# Altium project PolarGraph.PrjPcb
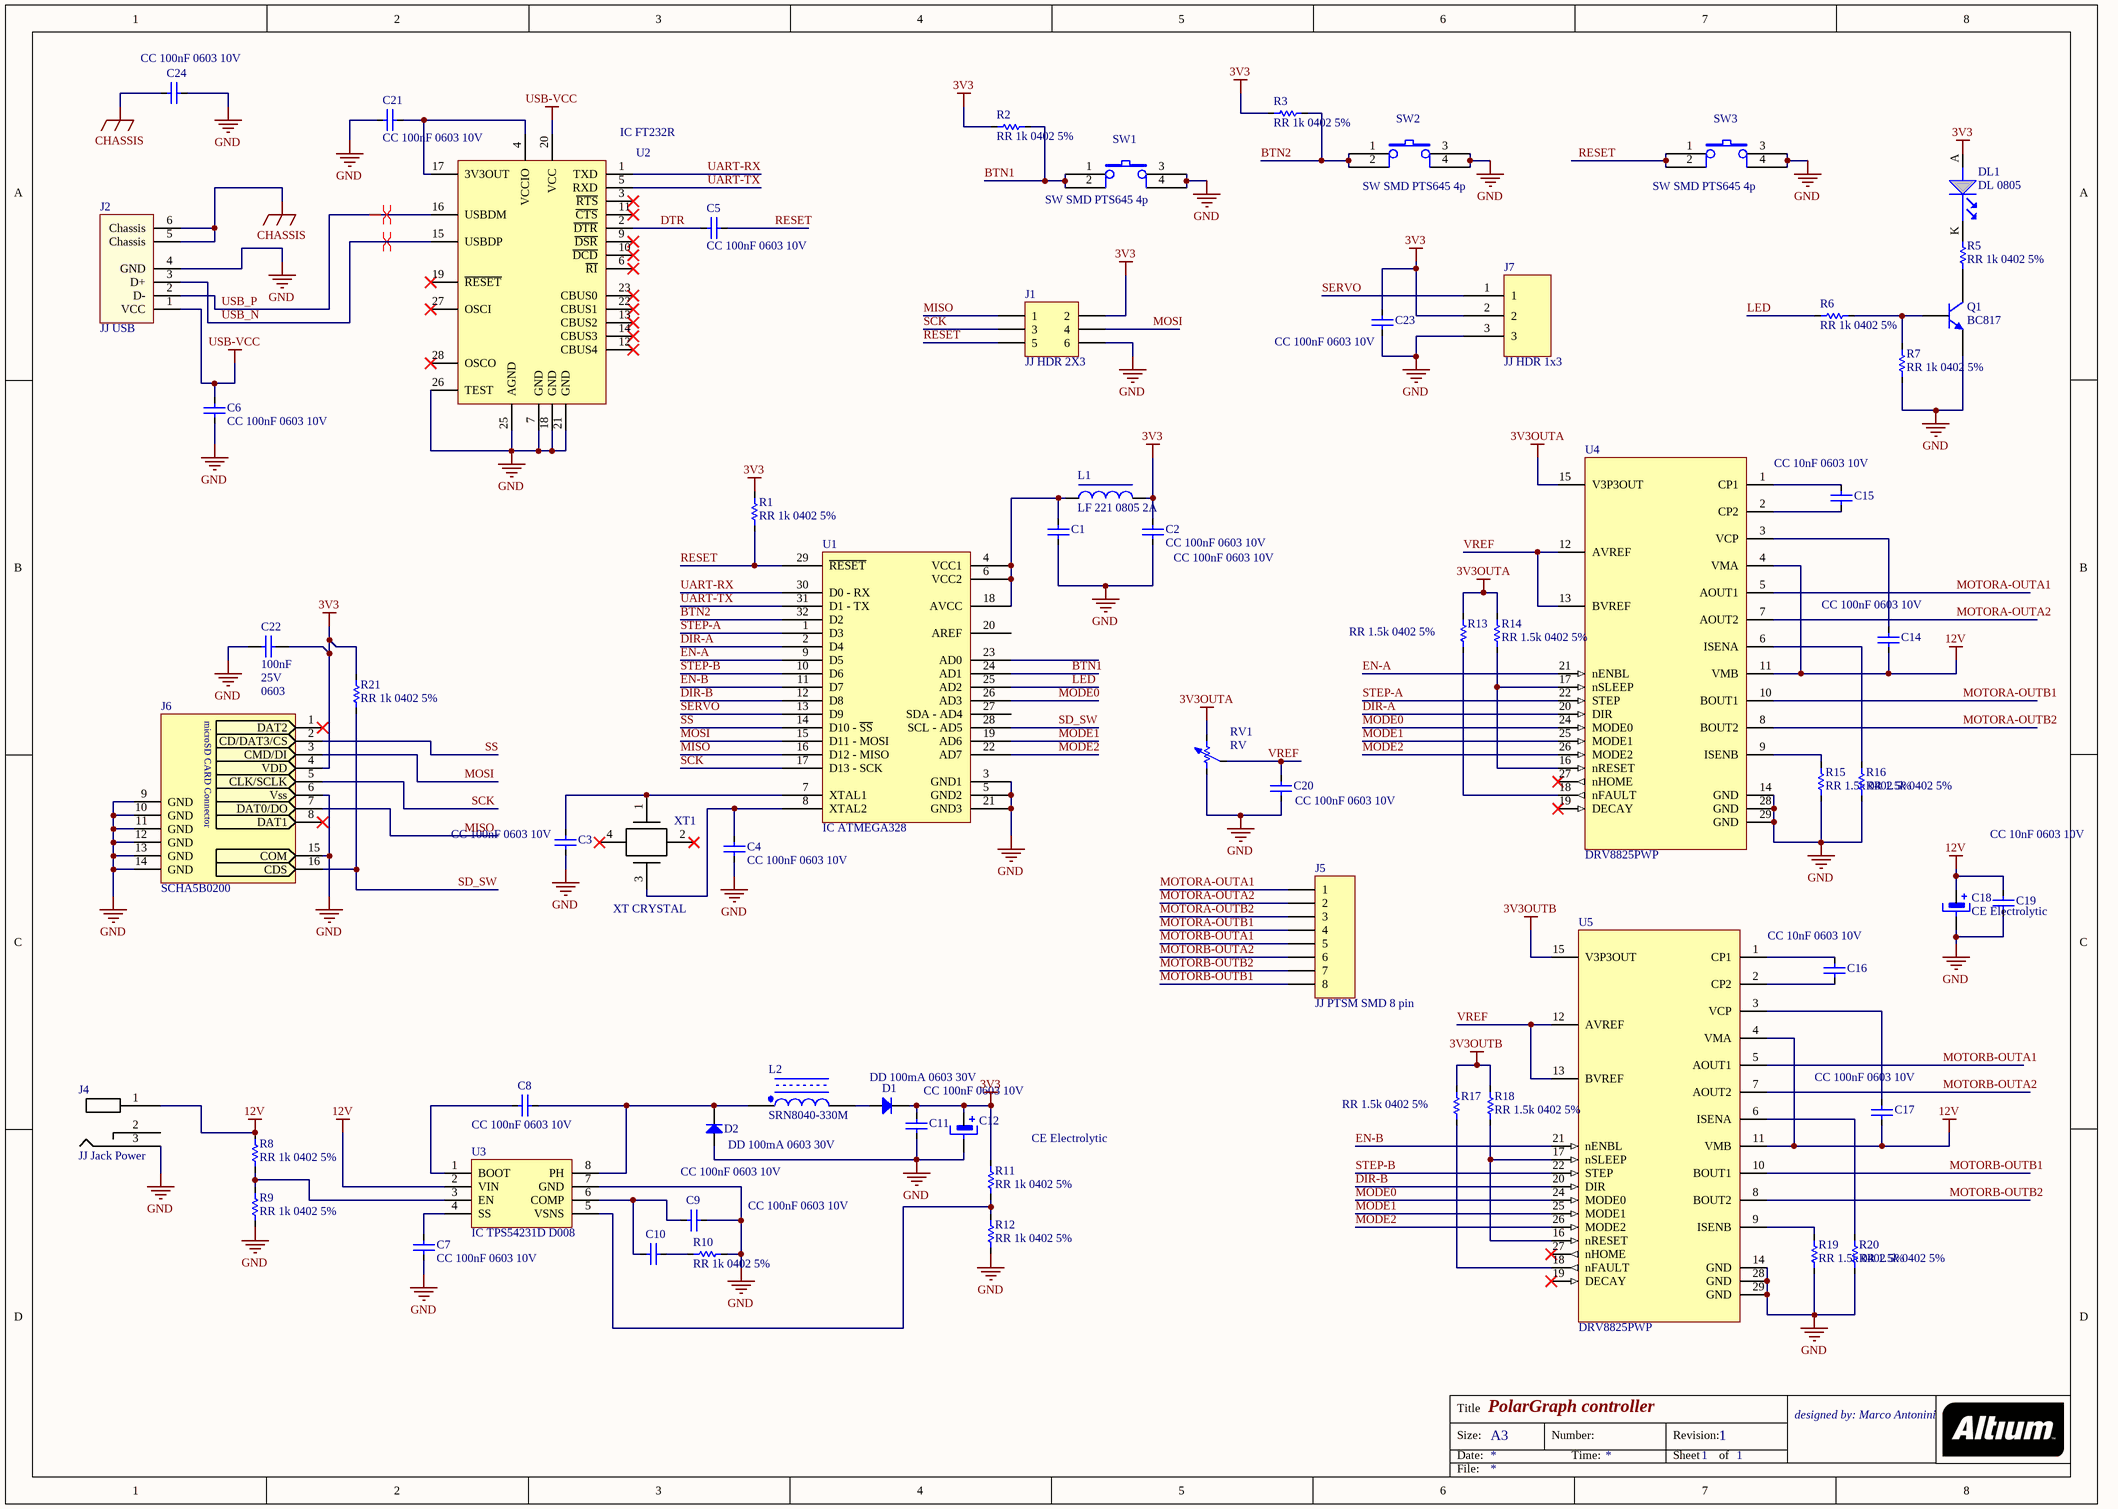
[diagram p0: PolarGraph.SchDoc]
2 sheets, 65 parts. Net scope: global (net labels, ports and power ports of the same name join across sheets).
Board file: PolarGraph.PcbDoc
Sheets:
  PolarGraph.SchDoc
  motorDriver.SchDoc

## Sheet PolarGraph.SchDoc: PolarGraph controller
size A3; ApprovedBy: I.C.T valle Umbra; DrawnBy: Marco Antonini; Address1: designed by: Marco Antonini; Revision: 1; SheetNumber: 1; SheetTotal: 1

### Parts
C1  CC 100nF 0603 10V  [CC 0603 (1608 metric)]
C2  CC 100nF 0603 10V  [CC 0603 (1608 metric)]
C3  CC 100nF 0603 10V  [CC 0603 (1608 metric)]
C4  CC 100nF 0603 10V  [CC 0603 (1608 metric)]
C5  CC 100nF 0603 10V  [CC 0603 (1608 metric)]
C6  CC 100nF 0603 10V  [CC 0603 (1608 metric)]
C7  CC 100nF 0603 10V  [CC 0603 (1608 metric)]
C8  CC 100nF 0603 10V  [CC 0603 (1608 metric)]
C9  CC 100nF 0603 10V  [CC 0603 (1608 metric)]
C10  CC 100nF 0603 10V  [CC 0603 (1608 metric)]
C11  CC 100nF 0603 10V  [CC 0805 (2012 metric)]
C12  CE Electrolytic  [CE 5.3x5.3x5.4]
C14  CC 100nF 0603 10V  [CC 0603 (1608 metric)]
C15  CC 10nF 0603 10V  [CC 0603 (1608 metric)]
C16  CC 10nF 0603 10V  [CC 0603 (1608 metric)]
C17  CC 100nF 0603 10V  [CC 0603 (1608 metric)]
C18  CE Electrolytic  [CE 6.6x6.6x5.4]
C19  CC 10nF 0603 10V  [CC 0805 (2012 metric)]
C20  CC 100nF 0603 10V  [CC 0603 (1608 metric)]
C21  CC 100nF 0603 10V  [CC 0603 (1608 metric)]
C22  value 100nF  Voltage: 25V  Package: 0603  [0603_C]  (hidden comment: Cap)
C23  CC 100nF 0603 10V  [CC 0805 (2012 metric)]
C24  CC 100nF 0603 10V  [CC 1808 (4520 metric)]
D1  DD 100mA 0603 30V  [DD SMA + SMB]
D2  DD 100mA 0603 30V  [DD SMA + SMB]
DL1  DL 0805  [LED 0805 - RED]
J1  JJ HDR 2X3  [HDR 2X3]
J2  JJ USB  [USB Type B]
J4  JJ Jack Power  [JACK POWER]
J5  JJ PTSM SMD 8 pin  [PTSM 0,5/ 8-2,5-H SMD]
J6  SCHA5B0200  [ALPS_SCHA5B0200]
J7  JJ HDR 1x3  [HDR 1x3]
L1  LF 221 0805 2A  [LL 0603 (1608 metric)]
L2  SRN8040-330M  [INDC8080X400N]
Q1  BC817  [SOT23_3]
R1  RR 1k 0402 5%  [RR 0603 (1608 metric)]
R2  RR 1k 0402 5%  [RR 0603 (1608 metric)]
R3  RR 1k 0402 5%  [RR 0603 (1608 metric)]
R5  RR 1k 0402 5%  [RR 0603 (1608 metric)]
R6  RR 1k 0402 5%  [RR 0603 (1608 metric)]
R7  RR 1k 0402 5%  [RR 0603 (1608 metric)]
R8  RR 1k 0402 5%  [RR 0603 (1608 metric)]
R9  RR 1k 0402 5%  [RR 0603 (1608 metric)]
R10  RR 1k 0402 5%  [RR 0603 (1608 metric)]
R11  RR 1k 0402 5%  [RR 0603 (1608 metric)]
R12  RR 1k 0402 5%  [RR 0603 (1608 metric)]
R13  RR 1.5k 0402 5%  [RR 0603 (1608 metric)]
R14  RR 1.5k 0402 5%  [RR 0603 (1608 metric)]
R15  RR 1.5k 0402 5%  [RR 0603 (1608 metric)]
R16  RR 1.5k 0402 5%  [RR 0603 (1608 metric)]
R17  RR 1.5k 0402 5%  [RR 0603 (1608 metric)]
R18  RR 1.5k 0402 5%  [RR 0603 (1608 metric)]
R19  RR 1.5k 0402 5%  [RR 0603 (1608 metric)]
R20  RR 1.5k 0402 5%  [RR 0603 (1608 metric)]
R21  RR 1k 0402 5%  [RR 0603 (1608 metric)]
RV1  RV  [RV ST-4EB]
SW1  SW SMD PTS645 4p  [Switch-4p PTS645]
SW2  SW SMD PTS645 4p  [Switch-4p PTS645]
SW3  SW SMD PTS645 4p  [Switch-4p PTS645]
U1  IC ATMEGA328  [TQFP32]
U2  IC FT232R  [SSOP28-FTDI]
U3  IC TPS54231D D008  [D008_M]
U4  DRV8825PWP  [SOP65P640X120_HS-28N]
U5  DRV8825PWP  [SOP65P640X120_HS-28N]
XT1  XT CRYSTAL  [CRYSTAL 3.8x10.3]

### Nets
3V3: C2.1 C11.1 C12.1 C22.2 C23.1 D1.K DL1.A J1.2 J6.4(VDD) J7.2 L1.2 R1.1 R2.2 R3.2 R11.2 R21.1
3V3OUTA: R13.2 R14.2 RV1.3 U4.15(V3P3OUT)
3V3OUTB: R17.2 R18.2 U5.15(V3P3OUT)
12V: C14.1 C17.1 C18.1 C19.2 J4.1 R8.2 U3.2(VIN) U4.4(VMA) U4.11(VMB) U5.4(VMA) U5.11(VMB)
CHASSIS: C24.1 J2.5(Chassis) J2.6(Chassis)
GND: C1.2 C2.2 C3.1 C4.1 C6.1 C7.2 C9.1 C11.2 C12.2 C18.2 C19.1 C20.2 C21.2 C22.1 C23.2 C24.2 D2.A J1.6 J2.4(GND) J4.3 J6.6(Vss) J6.9(GND) J6.10(GND) J6.11(GND) J6.12(GND) J6.13(GND) J6.14(GND) J6.15(COM) J7.3 Q1.2(E) R7.1 R9.1 R10.1 R12.1 R15.2 R16.2 R19.2 R20.2 RV1.1 SW1.3 SW1.4 SW2.3 SW2.4 SW3.3 SW3.4 U1.3(GND1) U1.5(GND2) U1.21(GND3) U2.7(GND) U2.18(GND) U2.21(GND) U2.25(AGND) U2.26(TEST) U3.7(GND) U4.14(GND) U4.28(GND) U4.29(GND) U5.14(GND) U5.28(GND) U5.29(GND)
USB-VCC: C6.2 J2.1(VCC) U2.20(VCC)
BTN1: R2.1 SW1.1 SW1.2 U1.24(AD1)
BTN2: R3.1 SW2.1 SW2.2 U1.32(D2)
DIR-A: U1.2(D4) U4.20(DIR)
DIR-B: U1.12(D8) U5.20(DIR)
DTR: C5.1 U2.2(~{DTR})
EN-A: U1.9(D5) U4.21(nENBL)
EN-B: U1.11(D7) U5.21(nENBL)
LED: R6.1 U1.25(AD2)
MISO: J1.1 J6.7(DAT0/DO) U1.16(D12_-_MISO)
MODE0: U1.26(AD3) U4.24(MODE0) U5.24(MODE0)
MODE1: U1.19(AD6) U4.25(MODE1) U5.25(MODE1)
MODE2: U1.22(AD7) U4.26(MODE2) U5.26(MODE2)
MOSI: J1.4 J6.3(CMD/DI) U1.15(D11_-_MOSI)
MOTORA-OUTA1: J5.1 U4.5(AOUT1)
MOTORA-OUTA2: J5.2 U4.7(AOUT2)
MOTORA-OUTB1: J5.4 U4.10(BOUT1)
MOTORA-OUTB2: J5.3 U4.8(BOUT2)
MOTORB-OUTA1: J5.5 U5.5(AOUT1)
MOTORB-OUTA2: J5.6 U5.7(AOUT2)
MOTORB-OUTB1: J5.8 U5.10(BOUT1)
MOTORB-OUTB2: J5.7 U5.8(BOUT2)
RESET: C5.2 J1.5 R1.2 SW3.1 SW3.2 U1.29(~{RESET})
SCK: J1.3 J6.5(CLK/SCLK) U1.17(D13_-_SCK)
SD_SW: J6.16(CDS) R21.2 U1.28(SCL_-_AD5)
SERVO: J7.1 U1.13(D9)
SS: J6.2(CD/DAT3/CS) U1.14(D10_-_~{SS})
STEP-A: U1.1(D3) U4.22(STEP)
STEP-B: U1.10(D6) U5.22(STEP)
UART-RX: U1.30(D0_-_RX) U2.1(TXD)
UART-TX: U1.31(D1_-_TX) U2.5(RXD)
USB_N: J2.3(D+) U2.15(USBDP)
USB_P: J2.2(D-) U2.16(USBDM)
VREF: C20.1 RV1.2 U4.12(AVREF) U4.13(BVREF) U5.12(AVREF) U5.13(BVREF)
NetC1_1: C1.1 L1.1 U1.4(VCC1) U1.6(VCC2) U1.18(AVCC)
NetC3_2: C3.2 U1.7(XTAL1) XT1.1(X1)
NetC4_2: C4.2 U1.8(XTAL2) XT1.3(X2)
NetC7_1: C7.1 U3.4(SS)
NetC8_1: C8.1 D2.K L2.1 U3.8(PH)
NetC8_2: C8.2 U3.1(BOOT)
NetC9_2: C9.2 C10.2 U3.6(COMP)
NetC10_1: C10.1 R10.2
NetC14_2: C14.2 U4.3(VCP)
NetC15_1: C15.1 U4.2(CP2)
NetC15_2: C15.2 U4.1(CP1)
NetC16_1: C16.1 U5.2(CP2)
NetC16_2: C16.2 U5.1(CP1)
NetC17_2: C17.2 U5.3(VCP)
NetC21_1: C21.1 U2.4(VCCIO) U2.17(3V3OUT)
NetD1_A: D1.A L2.2
NetDL1_K: DL1.K R5.2
NetQ1_1: Q1.1(B) R6.2 R7.2
NetQ1_3: Q1.3(C) R5.1
NetR8_1: R8.1 R9.2 U3.3(EN)
NetR11_1: R11.1 R12.2 U3.5(VSNS)
NetR13_1: R13.1 U4.18(nFAULT)
NetR14_1: R14.1 U4.16(nRESET) U4.17(nSLEEP)
NetR15_1: R15.1 U4.9(ISENB)
NetR16_1: R16.1 U4.6(ISENA)
NetR17_1: R17.1 U5.18(nFAULT)
NetR18_1: R18.1 U5.16(nRESET) U5.17(nSLEEP)
NetR19_1: R19.1 U5.9(ISENB)
NetR20_1: R20.1 U5.6(ISENA)

Not connected (* = marked no-connect by the designer): J4 2; J6 1(DAT2)* 8(DAT1)*; U1 20(AREF) 23(AD0) 27(SDA_-_AD4); U2 3(~{RTS})* 6(~{RI})* 9(~{DSR})* 10(~{DCD})* 11(~{CTS})* 12(CBUS4)* 13(CBUS2)* 14(CBUS3)* 19(~{RESET})* 22(CBUS1)* 23(CBUS0)* 27(OSCI)* 28(OSCO)*; U4 19(DECAY)* 27(nHOME)*; U5 19(DECAY)* 27(nHOME)*; XT1 2(GND)* 4(GND)*

### Layout directives
differential pair: USB_N, USB_P

### Notes on the sheet
- Title
- Size:
- Date:
- A3
- Number:
- Time:
- Revision:
- Sheet
- of
- File:
- (in symbol SCHA5B0200) microSD CARD Connector

### Library data of the parts
C1-C11 C14-C17 C19-C21 C23 C24 = CC Ceramic: Capacitor, Multi Layer Ceramic
C12 C18 = CE Electrolytic: Electrolytic Capacittor; Right: 20; Bottom: 10
C22 = C100nF-P0603-25V-X7R: Capacitor 0603, 100nF X7R 25V; CODE: CND000001; Data Check: NO; Part Number: C100nF-P0603-25V-X7R; Material: X7R; Temperature: -55°C +125°C; Manufacturer: *; ComponentLink1Description: Datasheet; ComponentLink1URL: *; ComponentLink2Description: *; ComponentLink2URL: *; Symbol Check: NO; Footprint Check: NO; Automotive: No
D1 D2 = DD Diode: Normal Diode; Published: 8-Jun-2000; LatestRevisionDate: 17-Jul-2002; LatestRevisionNote: Re-released for DXP Platform.; PackageReference: SMB; Publisher: Altium Limited; Code_JEDEC: DO-214-AA
DL1 = DL Diode Led: LED Diode 0805
J2 = JJ USB: USB Socket; Right: 30; Bottom: 70
J5 = JJ PTSM SMD 8 pin: Terminal Block 8 pin; Publisher: Acme Systems
J6 = SCHA5B0200: microSD Card Connector (Push-push Type) SCHA Series; Manufacturer: ALPS; CODE: HID000005; Data Check: NO; Symbol Check: OK; Part Number: SCHA5B0200; Temperature: -20°C +70°C; ComponentLink1Description: Datasheet; ComponentLink1URL: K:\DATASHEET\MECHANICAL\ALPS\SCHA.pdf; ComponentLink2Description: *; ComponentLink2URL: *; Footprint Check: OK; Automotive: No
L1 = LF Ferrite: Ferrite 220 Ohm 2A 0805; Right: 10; Bottom: 40
L2 = SRN8040-330M: Semi-shielded Power Inductors 33uH; Manufacturer: Bourns; CODE: IND000010; Data Check: NO; Symbol Check: OK; Part Number: SRN8040-330M; Value: 33uH; Temperature: -40°C +125°C; ComponentLink1Description: Datasheet; ComponentLink1URL: K:\DATASHEET\INDUCTOR\BOURNS\SRN8040.pdf; ComponentLink2URL: *; ComponentLink2Description: *; Footprint Check: OK; Automotive: No
R1-R3 R5-R21 = RR Resistor: Resistor; Publisher: ACME Systems
RV1 = RV: Resistor; Publisher: ACME Systems
SW1-SW3 = SW SMD PTS645 4p: Switch 4 pin PTS645
U2 = IC FT232R: The FT232BM is a USB to serial UART interface with the following advanced features
U3 = IC TPS54231D D008: DC-DC converter TPS54231D D008; Published: 15-Apr-2002; LatestRevisionDate: 13-Apr-2006; LatestRevisionNote: IPC-7351 Footprint Added.; DatasheetVersion: Jan-1989; PackageVersion: Jan-1998; PackageReference: D008; Publisher: Altium Limited; PackageDescription: 8-Pin Small Outline Integrated Circuit 1.27 mm Pitch; Code_IPC: SOIC127P600-8; ComponentLink1Description: Manufacturer Link; ComponentLink1URL: http://www.ti.com/
U4 U5 = DRV8825PWP: STEPPER MOTOR CONTROLLER IC; Manufacturer: Texas Instrument; CODE: ITG000001; Data Check: NO; Symbol Check: OK; Part Number: DRV8825PWP; Temperature: -40°C +85°C; ComponentLink1Description: Datasheet; ComponentLink1URL: K:\DATASHEET\IC\TEXAS INSTRUMENT\DRV8825.pdf; ComponentLink2Description: *; ComponentLink2URL: *; Footprint Check: OK; Automotive: No

## Sheet motorDriver.SchDoc: PolarGraph controller
size A3; ApprovedBy: I.C.T valle Umbra; DrawnBy: Marco Antonini; Address1: designed by: Marco Antonini; Revision: 1; SheetNumber: 1; SheetTotal: 1

### Notes on the sheet
- Title
- Size:
- Date:
- A3
- Number:
- Time:
- Revision:
- Sheet
- of
- File: